# EAGLE design TeensyAmp_R4.1b (EAGLE 9.6.2)

## Sheet 1 of 3
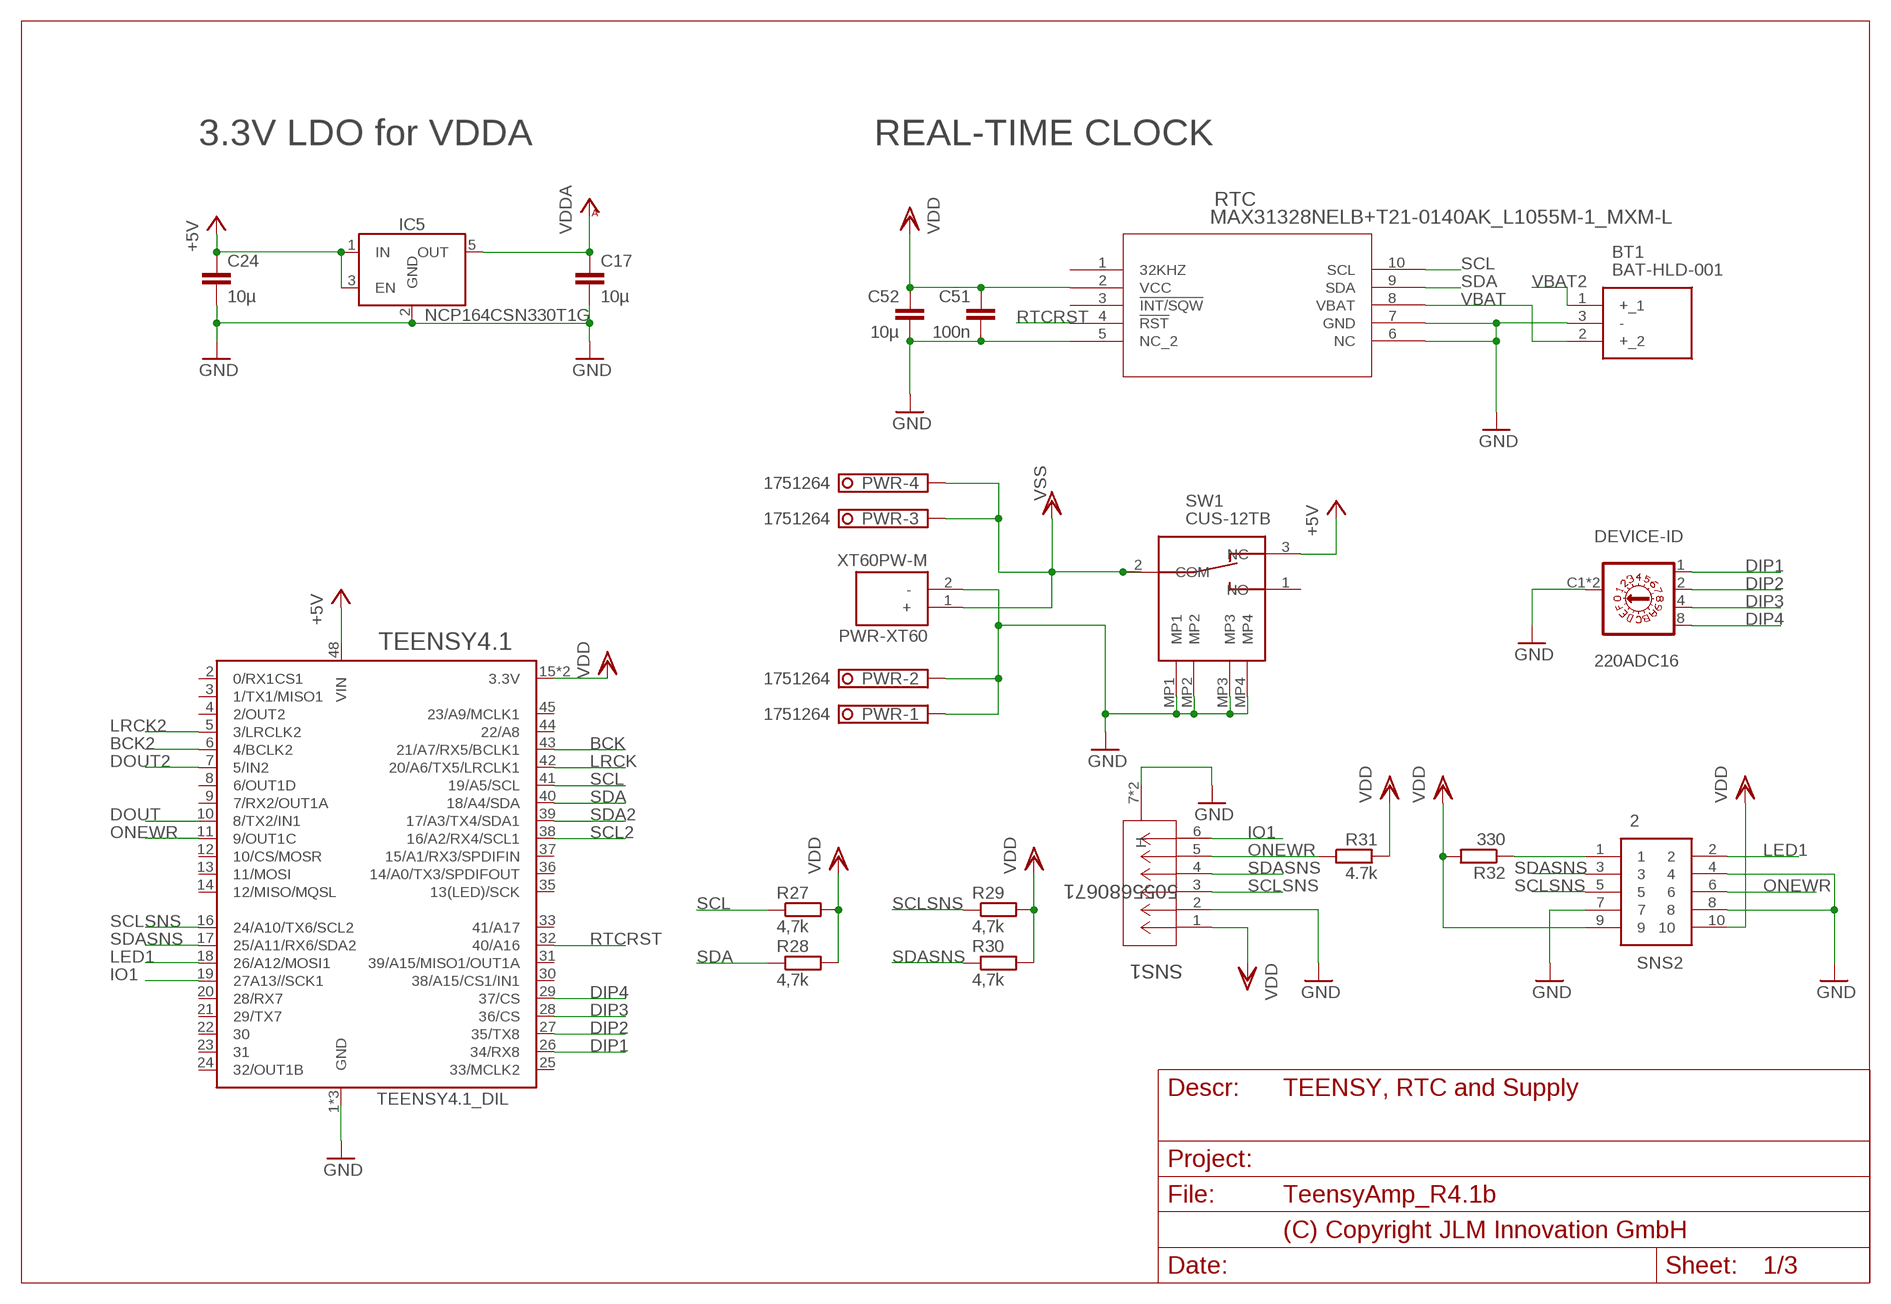
[diagram p0: schematic, sheet 1]
FRAME2 (DINA4_L): PAGE_DESCRIPTION: TEENSY, RTC and Supply

### Parts
BT1  BAT-HLD-001  [BATHLD001]
C17  10µ  C-EUC0603  [C0603]
C24  10µ  C-EUC0603  [C0603]
C51  100n  C-EUC0603  [C0603]
C52  10µ  C-EUC0603  [C0603]
DEVICE-ID  220ADC16  [220ADC16-CTS]
IC5  NCP164CSN330T1G  LDO_ENSOT23-5  [SOT23-5]
PWR  1751264  [1751264]
PWR-XT60  XT60PW-M  [AMASS_XT60PW-M]
R27  4,7k  R_JLMR0603  [R0603]
R28  4,7k  R_JLMR0603  [R0603]
R29  4,7k  R_JLMR0603  [R0603]
R30  4,7k  R_JLMR0603  [R0603]
R31  4.7k  R_JLMR0603  [R0603]
R32  330  R_JLMR0603  [R0603]
RTC  MAX31328NELB+T21-0140AK_L1055M-1_MXM-L  [21-0140AK_L1055M-1_MXM-L]
SNS1  5055680671  [CONN_50556806XX_MOL]
SNS2  2  JUMPER2X5  [JUMPER2X5FP]
SW1  CUS-12TB  [CUS12TB]
TEENSY4.1  TEENSY4.1_DIL  [TEENSY4.1_DIL]

### Nets
+5V: C24.1 IC5.1(IN) IC5.3(EN) SW1.3(NC) TEENSY4.1.48(VIN)
BCK: TEENSY4.1.43(21/A7/RX5/BCLK1) ; also sheet 2,3
BCK2: TEENSY4.1.6(4/BCLK2)
DIP1: DEVICE-ID.1 TEENSY4.1.26(34/RX8)
DIP2: DEVICE-ID.2 TEENSY4.1.27(35/TX8)
DIP3: DEVICE-ID.4 TEENSY4.1.28(36/CS)
DIP4: DEVICE-ID.8 TEENSY4.1.29(37/CS)
DOUT: TEENSY4.1.10(8/TX2/IN1) ; also sheet 2,3
DOUT2: TEENSY4.1.7(5/IN2)
GND: BT1.3(-) C17.2 C24.2 C51.2 C52.2 DEVICE-ID.C1(C) DEVICE-ID.C2(C) IC5.2(GND) PWR-XT60.2(-) PWR.1 PWR.2 RTC.5(NC_2) RTC.6(NC) RTC.7(GND) SNS1.2 SNS1.7(H) SNS1.8(H) SNS2.4 SNS2.7 SNS2.8 SW1.MP1 SW1.MP2 SW1.MP3 SW1.MP4 TEENSY4.1.1(GND) TEENSY4.1.34(GND) TEENSY4.1.47(GND) ; also sheet 2,3
IO1: SNS1.6 TEENSY4.1.19(27A13//SCK1)
LED1: SNS2.2 TEENSY4.1.18(26/A12/MOSI1)
LRCK: TEENSY4.1.42(20/A6/TX5/LRCLK1) ; also sheet 2,3
LRCK2: TEENSY4.1.5(3/LRCLK2)
N$1: R32.1 SNS2.1
ONEWR: R31.1 SNS1.5 SNS2.6 TEENSY4.1.11(9/OUT1C)
RTCRST: RTC.4(!RST) TEENSY4.1.32(40/A16)
SCL: R27.1 RTC.10(SCL) TEENSY4.1.41(19/A5/SCL) ; also sheet 2,3
SCL2: TEENSY4.1.38(16/A2/RX4/SCL1)
SCLSNS: R29.1 SNS1.3 SNS2.5 TEENSY4.1.16(24/A10/TX6/SCL2)
SDA: R28.1 RTC.9(SDA) TEENSY4.1.40(18/A4/SDA) ; also sheet 2,3
SDA2: TEENSY4.1.39(17/A3/TX4/SDA1)
SDASNS: R30.1 SNS1.4 SNS2.3 TEENSY4.1.17(25/A11/RX6/SDA2)
VBAT: BT1.2(+_2) RTC.8(VBAT)
VBAT2: BT1.1(+_1)
VDD: C51.1 C52.1 R27.2 R28.2 R29.2 R30.2 R31.2 R32.2 RTC.2(VCC) SNS1.1 SNS2.9 SNS2.10 TEENSY4.1.15(3.3V) TEENSY4.1.46(3.3V) ; also sheet 2,3
VDDA: C17.1 IC5.5(OUT) ; also sheet 2,3
VSS: PWR-XT60.1(+) PWR.3 PWR.4 SW1.2(COM)
Unconnected: RTC.1(32KHZ) RTC.3(!INT/SQW) SW1.1(NO) TEENSY4.1.2(0/RX1CS1) TEENSY4.1.3(1/TX1/MISO1) TEENSY4.1.4(2/OUT2) TEENSY4.1.8(6/OUT1D) TEENSY4.1.9(7/RX2/OUT1A) TEENSY4.1.12(10/CS/MOSR) TEENSY4.1.13(11/MOSI) TEENSY4.1.14(12/MISO/MQSL) TEENSY4.1.20(28/RX7) TEENSY4.1.21(29/TX7) TEENSY4.1.22 TEENSY4.1.23 TEENSY4.1.24(32/OUT1B) TEENSY4.1.25(33/MCLK2) TEENSY4.1.30(38/A15/CS1/IN1) TEENSY4.1.31(39/A15/MISO1/OUT1A) TEENSY4.1.33(41/A17) TEENSY4.1.35(13(LED)/SCK) TEENSY4.1.36(14/A0/TX3/SPDIFOUT) TEENSY4.1.37(15/A1/RX3/SPDIFIN) TEENSY4.1.44(22/A8) TEENSY4.1.45(23/A9/MCLK1)

### Notes on the sheet
- 3.3V LDO for VDDA | REAL-TIME CLOCK

## Sheet 2 of 3
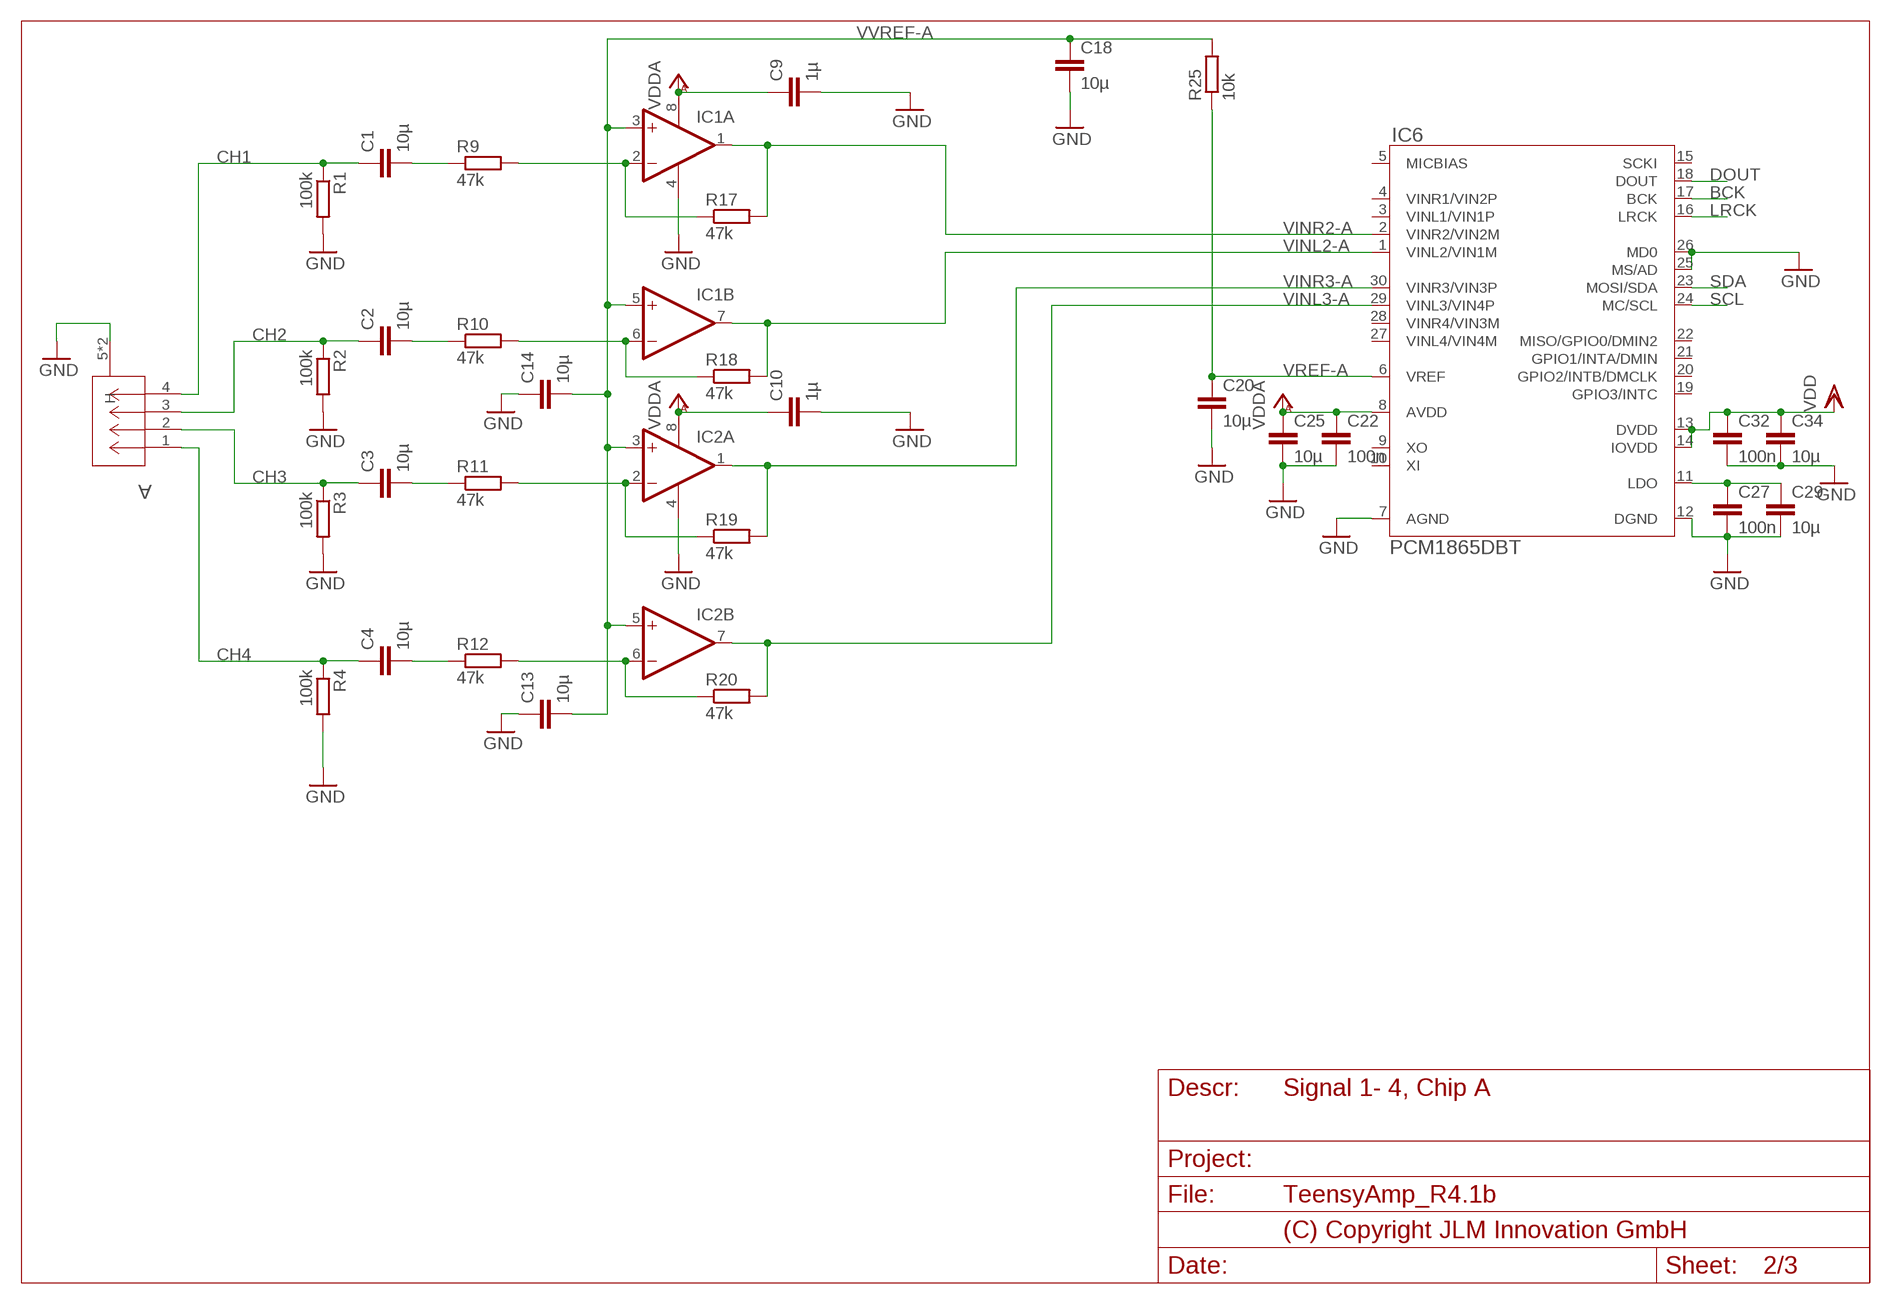
[diagram p1: schematic, sheet 2]
FRAME1 (DINA4_L): PAGE_DESCRIPTION: Signal 1- 4, Chip A

### Parts
A  5055670471  [CONN04_5055670471_MOL]
C1  10µ  C-EUC0805  [C0805]
C2  10µ  C-EUC0805  [C0805]
C3  10µ  C-EUC0805  [C0805]
C4  10µ  C-EUC0805  [C0805]
C9  1µ  C-EUC0603  [C0603]
C10  1µ  C-EUC0603  [C0603]
C13  10µ  C-EUC0603  [C0603]
C14  10µ  C-EUC0603  [C0603]
C18  10µ  C-EUC0603  [C0603]
C20  10µ  C-EUC0603  [C0603]
C22  100n  C-EUC0603  [C0603]
C25  10µ  C-EUC0603  [C0603]
C27  100n  C-EUC0603  [C0603]
C29  10µ  C-EUC0603  [C0603]
C32  100n  C-EUC0603  [C0603]
C34  10µ  C-EUC0603  [C0603]
IC1  OPA2344E  [MSOP08]
IC2  OPA2344E  [MSOP08]
IC6  PCM1865DBT  [SOP50P640X120-30N]
R1  100k  R_JLMR0603  [R0603]
R2  100k  R_JLMR0603  [R0603]
R3  100k  R_JLMR0603  [R0603]
R4  100k  R_JLMR0603  [R0603]
R9  47k  R_JLMR0603  [R0603]
R10  47k  R_JLMR0603  [R0603]
R11  47k  R_JLMR0603  [R0603]
R12  47k  R_JLMR0603  [R0603]
R17  47k  R_JLMR0603  [R0603]
R18  47k  R_JLMR0603  [R0603]
R19  47k  R_JLMR0603  [R0603]
R20  47k  R_JLMR0603  [R0603]
R25  10k  R_JLMR0603  [R0603]

### Nets
BCK: IC6.17(BCK) ; also sheet 1,3
CH1: A.4 C1.1 R1.1
CH2: A.3 C2.1 R2.1
CH3: A.2 C3.1 R3.1
CH4: A.1 C4.1 R4.1
DOUT: IC6.18(DOUT) ; also sheet 1,3
GND: A.5(H) A.6(H) C9.2 C10.2 C13.1 C14.1 C18.2 C20.2 C22.2 C25.2 C27.2 C29.2 C32.2 C34.2 IC1.4(A:V-) IC2.4(A:V-) IC6.7(AGND) IC6.12(DGND) IC6.25(MS/AD) IC6.26(MD0) R1.2 R2.2 R3.2 R4.2 ; also sheet 1,3
LRCK: IC6.16(LRCK) ; also sheet 1,3
N$11: C27.1 C29.1 IC6.11(LDO)
N$23: C2.2 R10.1
N$24: C3.2 R11.1
N$25: C1.2 R9.1
N$26: C4.2 R12.1
N$31: IC1.2(A:-IN) R9.2 R17.1
N$32: IC1.6(B:-IN) R10.2 R18.1
N$33: IC2.2(A:-IN) R11.2 R19.1
N$34: IC2.6(B:-IN) R12.2 R20.1
SCL: IC6.24(MC/SCL) ; also sheet 1,3
SDA: IC6.23(MOSI/SDA) ; also sheet 1,3
VDD: C32.1 C34.1 IC6.13(DVDD) IC6.14(IOVDD) ; also sheet 1,3
VDDA: C9.1 C10.1 C22.1 C25.1 IC1.8(A:V+) IC2.8(A:V+) IC6.8(AVDD) ; also sheet 1,3
VINL2-A: IC1.7(B:OUT) IC6.1(VINL2/VIN1M) R18.2
VINL3-A: IC2.7(B:OUT) IC6.29(VINL3/VIN4P) R20.2
VINR2-A: IC1.1(A:OUT) IC6.2(VINR2/VIN2M) R17.2
VINR3-A: IC2.1(A:OUT) IC6.30(VINR3/VIN3P) R19.2
VREF-A: C20.1 IC6.6(VREF) R25.1
VVREF-A: C13.2 C14.2 C18.1 IC1.3(A:+IN) IC1.5(B:+IN) IC2.3(A:+IN) IC2.5(B:+IN) R25.2
Unconnected: IC6.3(VINL1/VIN1P) IC6.4(VINR1/VIN2P) IC6.5(MICBIAS) IC6.9(XO) IC6.10(XI) IC6.15(SCKI) IC6.19(GPIO3/INTC) IC6.20(GPIO2/INTB/DMCLK) IC6.21(GPIO1/INTA/DMIN) IC6.22(MISO/GPIO0/DMIN2) IC6.27(VINL4/VIN4M) IC6.28(VINR4/VIN3M)

## Sheet 3 of 3
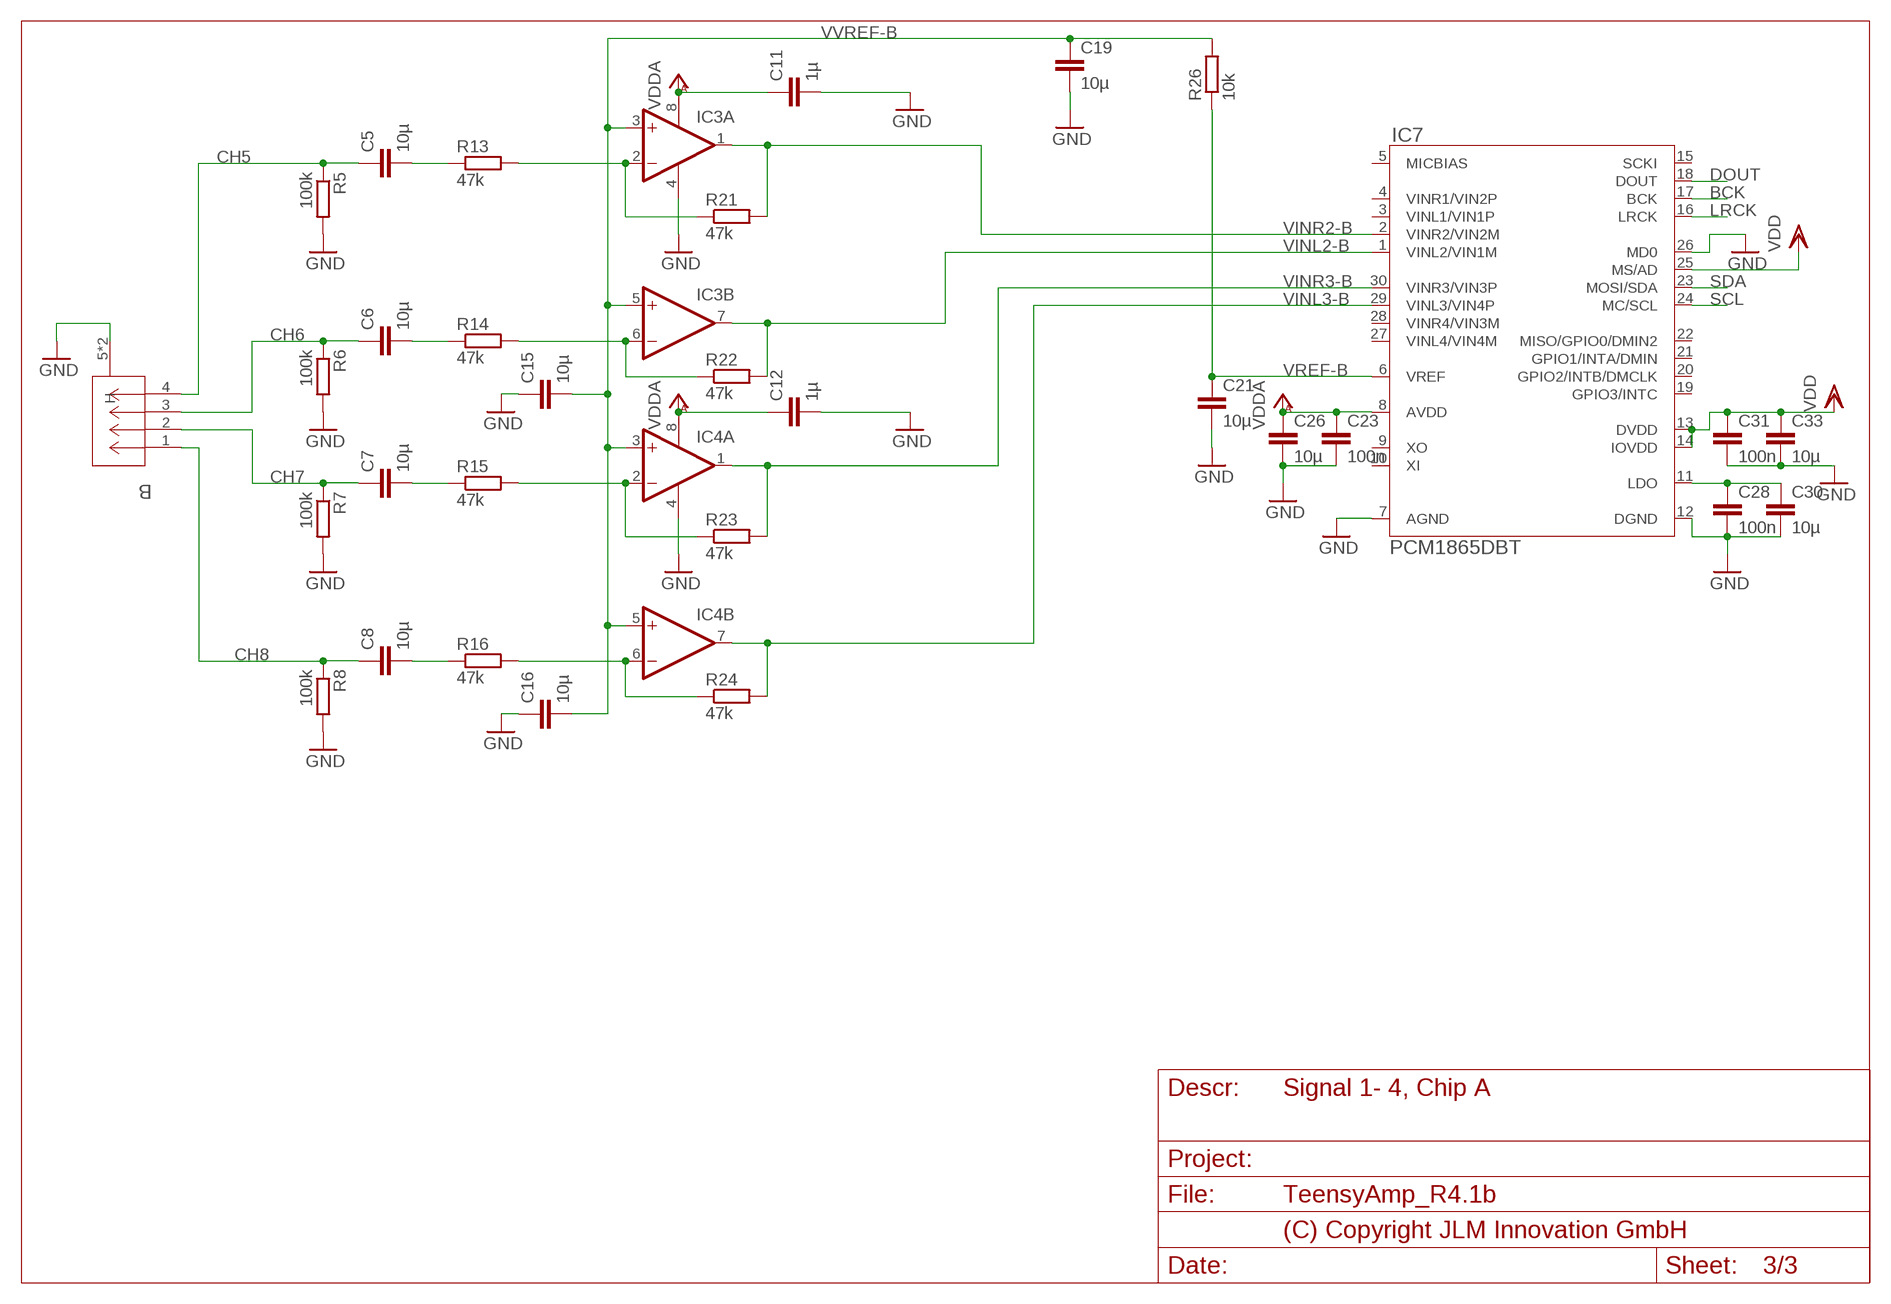
[diagram p2: schematic, sheet 3]
FRAME3 (DINA4_L): PAGE_DESCRIPTION: Signal 1- 4, Chip A

### Parts
B  5055670471  [CONN04_5055670471_MOL]
C5  10µ  C-EUC0805  [C0805]
C6  10µ  C-EUC0805  [C0805]
C7  10µ  C-EUC0805  [C0805]
C8  10µ  C-EUC0805  [C0805]
C11  1µ  C-EUC0603  [C0603]
C12  1µ  C-EUC0603  [C0603]
C15  10µ  C-EUC0603  [C0603]
C16  10µ  C-EUC0603  [C0603]
C19  10µ  C-EUC0603  [C0603]
C21  10µ  C-EUC0603  [C0603]
C23  100n  C-EUC0603  [C0603]
C26  10µ  C-EUC0603  [C0603]
C28  100n  C-EUC0603  [C0603]
C30  10µ  C-EUC0603  [C0603]
C31  100n  C-EUC0603  [C0603]
C33  10µ  C-EUC0603  [C0603]
IC3  OPA2344E  [MSOP08]
IC4  OPA2344E  [MSOP08]
IC7  PCM1865DBT  [SOP50P640X120-30N]
R5  100k  R_JLMR0603  [R0603]
R6  100k  R_JLMR0603  [R0603]
R7  100k  R_JLMR0603  [R0603]
R8  100k  R_JLMR0603  [R0603]
R13  47k  R_JLMR0603  [R0603]
R14  47k  R_JLMR0603  [R0603]
R15  47k  R_JLMR0603  [R0603]
R16  47k  R_JLMR0603  [R0603]
R21  47k  R_JLMR0603  [R0603]
R22  47k  R_JLMR0603  [R0603]
R23  47k  R_JLMR0603  [R0603]
R24  47k  R_JLMR0603  [R0603]
R26  10k  R_JLMR0603  [R0603]

### Nets
BCK: IC7.17(BCK) ; also sheet 1,2
CH5: B.4 C5.1 R5.1
CH6: B.3 C6.1 R6.1
CH7: B.2 C7.1 R7.1
CH8: B.1 C8.1 R8.1
DOUT: IC7.18(DOUT) ; also sheet 1,2
GND: B.5(H) B.6(H) C11.2 C12.2 C15.1 C16.1 C19.2 C21.2 C23.2 C26.2 C28.2 C30.2 C31.2 C33.2 IC3.4(A:V-) IC4.4(A:V-) IC7.7(AGND) IC7.12(DGND) IC7.26(MD0) R5.2 R6.2 R7.2 R8.2 ; also sheet 1,2
LRCK: IC7.16(LRCK) ; also sheet 1,2
N$43: C28.1 C30.1 IC7.11(LDO)
N$48: IC3.2(A:-IN) R13.2 R21.1
N$49: IC3.6(B:-IN) R14.2 R22.1
N$50: IC4.2(A:-IN) R15.2 R23.1
N$51: IC4.6(B:-IN) R16.2 R24.1
N$52: C6.2 R14.1
N$53: C7.2 R15.1
N$54: C8.2 R16.1
N$55: C5.2 R13.1
SCL: IC7.24(MC/SCL) ; also sheet 1,2
SDA: IC7.23(MOSI/SDA) ; also sheet 1,2
VDD: C31.1 C33.1 IC7.13(DVDD) IC7.14(IOVDD) IC7.25(MS/AD) ; also sheet 1,2
VDDA: C11.1 C12.1 C23.1 C26.1 IC3.8(A:V+) IC4.8(A:V+) IC7.8(AVDD) ; also sheet 1,2
VINL2-B: IC3.7(B:OUT) IC7.1(VINL2/VIN1M) R22.2
VINL3-B: IC4.7(B:OUT) IC7.29(VINL3/VIN4P) R24.2
VINR2-B: IC3.1(A:OUT) IC7.2(VINR2/VIN2M) R21.2
VINR3-B: IC4.1(A:OUT) IC7.30(VINR3/VIN3P) R23.2
VREF-B: C21.1 IC7.6(VREF) R26.1
VVREF-B: C15.2 C16.2 C19.1 IC3.3(A:+IN) IC3.5(B:+IN) IC4.3(A:+IN) IC4.5(B:+IN) R26.2
Unconnected: IC7.3(VINL1/VIN1P) IC7.4(VINR1/VIN2P) IC7.5(MICBIAS) IC7.9(XO) IC7.10(XI) IC7.15(SCKI) IC7.19(GPIO3/INTC) IC7.20(GPIO2/INTB/DMCLK) IC7.21(GPIO1/INTA/DMIN) IC7.22(MISO/GPIO0/DMIN2) IC7.27(VINL4/VIN4M) IC7.28(VINR4/VIN3M)

## Library data of the parts
A B = teensyamp:5055670471: molex micro-lock plus horizontal header 4 pins; COPYRIGHT: Copyright (C) 2025 Ultra Librarian. All rights reserved.; MANUFACTURER_PART_NUMBER: 5055670471; MFR_NAME: Molex Connector Corporation
BT1 = teensyamp:BAT-HLD-001: Battery Holders, CR2032, 1 Position, Horizontal, Nickel, PCB Mount Alignment, Power, -40 257 F [-40 125 C] Source: Datasheet <https://www.te.com/commerce/DocumentDelivery/DDEController?Action=showdoc&DocId=Customer DrawingC-BAT-HLD-001-xxEpdfEnglishENG_CD_C-BAT-HLD-001-xx_E.pdfBAT-HLD-001>; DESCRIPTION: Battery Holders, CR2032, 1 Position, Horizontal, Nickel, PCB Mount Alignment, Power, -40 257 F [-40 125 C]; HEIGHT: 4.3mm; MANUFACTURER_NAME: TE Connectivity; MANUFACTURER_PART_NUMBER: BAT-HLD-001; MOUSER_PART_NUMBER: 712-BAT-HLD-001; MOUSER_PRICE-STOCK: https://www.mouser.co.uk/ProductDetail/TE-Connectivity-Linx-Technologies/BAT-HLD-001?qs=K5ta8V%252BWhta7hbVGfm4dqA%3D%3D
C1-C34 C51 C52 = jlm_cap:C-EU: CAPACITOR, European symbol
DEVICE-ID = teensyamp:220ADC16: DIL/CODE SWITCH; MPN: DRS3016; OC_FARNELL: 1190425; OC_NEWARK: 01M7367
IC1-IC4 = jlm_linear:OPA2*: Dual Operational Amplifier Low Power, Single-Supply, Rail-To-Rail Operational Amplifier Source: http://focus.ti.com/lit/ds/symlink/opa2345.pdf http://focus.ti.com .. opa241.pdf http://focus.ti.com/lit/ds/symlink/opa2134.pdf
IC5 = jlm_power:LDO_EN; OC_FARNELL: 3367831; OC_MOUSER: 863-NCP164CSN330T1G
IC6 IC7 = jlm_adc_dac:PCM1865: PCM1865 4-Channel, 192-kHz, Audio ADCs; OC_MOUSER: 595-PCM1865DBT
PWR = jlm_con:1751264: MKDS 1/ 4-3,5 Printklemme Nennstrom: 10 A Bemessungsspannung: 160 V Raster: 3,5 mm Polzahl: 4 Montageart: Löten Anschlussart: Schraubanschluss Anschlussrichtung vom Leiter zur Platine: 0° Source: http://eshop.phoenixcontact.com .. 1751264.pdf; MPN: 1751264; OC_FARNELL: 2478588; OC_NEWARK: 10R0934
PWR-XT60 = teensyamp:XT60PW-M: XT60 male through hole; AVAILABILITY: Not in stock; CHECK_PRICES: https://www.snapeda.com/parts/XT60PW-M/AMASS/view-part/?ref=eda; DESCRIPTION: Socket, DC supply, male, PIN: 2; MF: AMASS; MP: XT60PW-M; PACKAGE: Package; PRICE: None; SNAPEDA_LINK: https://www.snapeda.com/parts/XT60PW-M/AMASS/view-part/?ref=snap
R1-R32 = jlm_resistors:R_JLM: RESISTOR, European symbol
RTC = teensyamp:MAX31328NELB+T: MAX31328 real-time clock; COPYRIGHT: Copyright (C) 2025 Ultra Librarian. All rights reserved.; MANUFACTURER_PART_NUMBER: MAX31328NELB+T; MFR_NAME: Analog Devices Inc
SNS1 = teensyamp:5055680671: molex micro-lock plus vertical header 6 pins; COPYRIGHT: Copyright (C) 2025 Ultra Librarian. All rights reserved.; MANUFACTURER_PART_NUMBER: 5055680671; MFR_NAME: Molex Connector Corporation
SNS2 = teensyamp:JUMPER2X5: Jumper with 10 pins in 2 rows
SW1 = teensyamp:CUS-12TB: Slide Switches smd low profile slide switch, 1P2T, gull wing Source: Datasheet <https://www.nidec-copal-electronics.com/e/catalog/switch/cus.pdf>; DESCRIPTION: Slide Switches smd low profile slide switch, 1P2T, gull wing; HEIGHT: 1.4mm; MANUFACTURER_NAME: Nidec Copal; MANUFACTURER_PART_NUMBER: CUS-12TB
TEENSY4.1 = jlm_micro:TEENSY4.1_DIL

## Net classes
0 default: clearance 0.205 mm

## Board
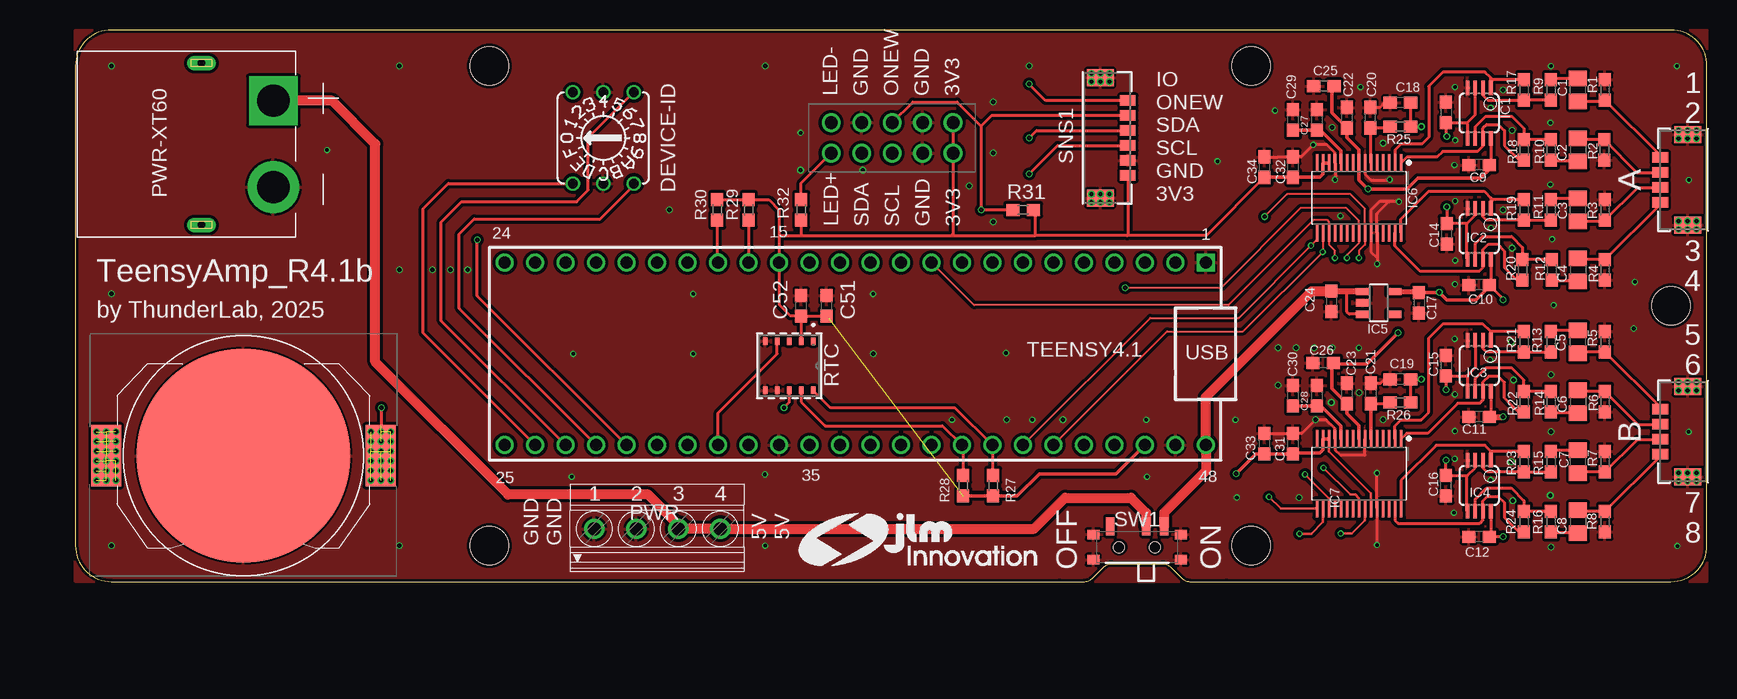
[diagram p3: board, top side]
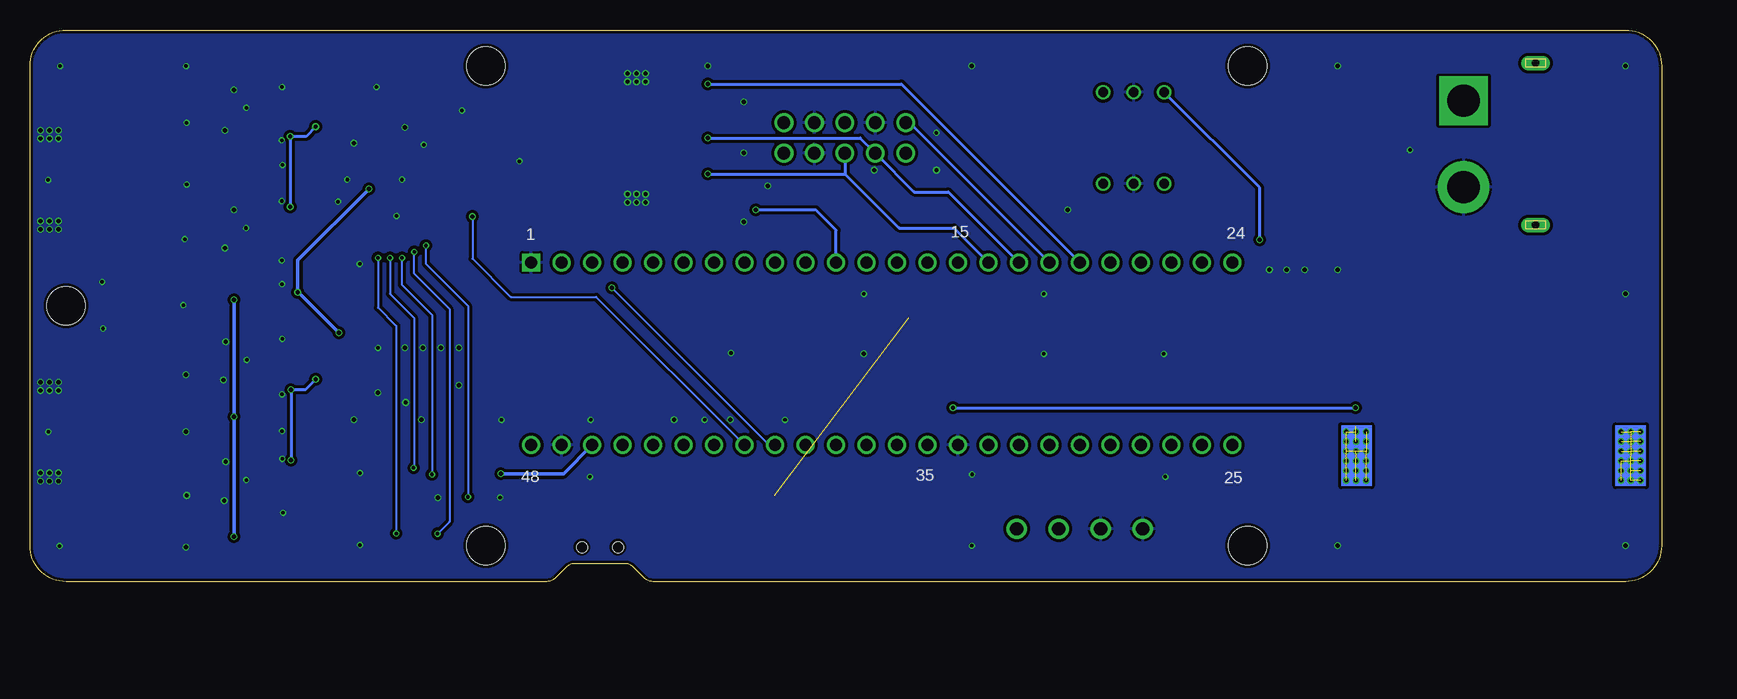
[diagram p4: board, bottom side, seen from below]

Size 136 x 46 mm. Coordinates in mm from the lower left corner, seen from the top.
Outline: 82,0 3,0 arc-90 0,3 0,43 arc-90 3,46 133,46 arc-90 136,43 136,3 arc-90 133,0 96,0
Outline: 82,0 82.09,0
Outline: 95.91,0 96,0
Outline: 82,0 84.09,0 arc45 84.79,0.29 85.71,1.21 arc-45 86.41,1.5 90.59,1.5 arc-45 91.29,1.21 92.21,0.29 arc45 92.91,0 96,0
Copper layers (1*16): Top 0.018mm / dielectric 1.55mm / Bottom 0.018mm
Design rules "Multi-CB_2L_100цm-Tracks_OL35цm *": minimum track width 0.1mm, minimum drill 0.2mm, track to track 0.1mm, track to pad 0.1mm, pad to pad 0.1mm, via to via 0.1mm, smd to smd 0mil, copper to edge 0.2mm, drill to drill 0.2mm, minimum pad ring 0.125mm, minimum via ring 0.1mm, stop-mask expansion 2mil, vias tented up to drill 0mil, thermal gap 0.2mm
Holes 3.2 mm at 34.5,3 98,3 34.5,43 98,43 133,23

### Footprints (pad centres in the part's own frame; a part is rotated, then mirrored left to right if it is on the bottom)
CONN04_5055670471_MOL = smd 0.838 x 1.295: 1 1.875,-1.894; 2 0.625,-1.894; 3 -0.625,-1.894; 4 -1.875,-1.894 | smd 1.397 x 2.261: 5 -3.775,0.401; 6 3.775,0.401
BATHLD001 = smd 2.5 x 5.1: 1 -11.45,0; 2 11.43,0 | smd 17.8 x 17.8: 3 0,0
C0805 = smd 1.3 x 1.5: 1 -0.95,0; 2 0.95,0
C0603 = smd 1.1 x 1: 1 -0.85,0; 2 0.85,0
220ADC16-CTS = drill 0.8: 1 -3.81,2.54; 2 3.81,-2.54; 4 -3.81,-2.54; 8 3.81,2.54; C1 -3.81,0; C2 3.81,0
MSOP08 = smd 0.3 x 1.2: 1 -0.976,-2.113; 2 -0.326,-2.113; 3 0.324,-2.113; 4 0.974,-2.113; 5 0.974,2.112; 6 0.324,2.112; 7 -0.326,2.112; 8 -0.976,2.112
SOT23-5 = smd 0.6 x 1.2: 1 -0.95,-1.306; 2 0,-1.306; 3 0.95,-1.306; 4 0.95,1.306; 5 -0.95,1.306
SOP50P640X120-30N = smd 1.5 x 0.28: 1 -2.9,3.5; 2 -2.9,3; 3 -2.9,2.5; 4 -2.9,2; 5 -2.9,1.5; 6 -2.9,1; 7 -2.9,0.5; 8 -2.9,0; 9 -2.9,-0.5; 10 -2.9,-1; 11 -2.9,-1.5; 12 -2.9,-2; 13 -2.9,-2.5; 14 -2.9,-3; 15 -2.9,-3.5; 16 2.9,-3.5; 17 2.9,-3; 18 2.9,-2.5; 19 2.9,-2; 20 2.9,-1.5; 21 2.9,-1; 22 2.9,-0.5; 23 2.9,0; 24 2.9,0.5; 25 2.9,1; 26 2.9,1.5; 27 2.9,2; 28 2.9,2.5; 29 2.9,3; 30 2.9,3.5
1751264 = drill 1.1 pad 1.7: 1 -5.25,-0.1; 2 -1.75,-0.1; 3 1.75,-0.1; 4 5.25,-0.1
AMASS_XT60PW-M = drill 2.7 pad 4.064 square: 1 3.6,-6 | drill 2.7 pad 4.318: 2 -3.6,-6 | drill 0.6 pad 1.2 long: S1 6.75,0; S2 -6.75,0
R0603 = smd 1.1 x 1: 1 -0.85,0; 2 0.85,0
21-0140AK_L1055M-1_MXM-L = smd 0.61 x 0.406: 1 -2.045,2; 2 -2.045,1; 3 -2.045,0; 4 -2.045,-1; 5 -2.045,-2; 6 2.045,-2; 7 2.045,-1; 8 2.045,0; 9 2.045,1; 10 2.045,2
CONN_50556806XX_MOL = smd 0.838 x 1.295: 1 -3.125,-1.72; 2 -1.875,-1.72; 3 -0.625,-1.72; 4 0.625,-1.72; 5 1.875,-1.72; 6 3.125,-1.72 | smd 1.397 x 2.261: 7 -5.025,0.575; 8 5.025,0.575
JUMPER2X5FP = drill 1.05 pad 1.575: 1 0,-1.27; 2 0,1.27; 3 2.54,-1.27; 4 2.54,1.27; 5 5.08,-1.27; 6 5.08,1.27; 7 7.62,-1.27; 8 7.62,1.27; 9 10.16,-1.27; 10 10.16,1.27
CUS12TB = smd 0.7 x 1.5: 1 -0.75,1.75; 2 2.25,1.75; 3 3.75,1.75 | smd 1 x 0.8: MP1 -2.15,1.05; MP2 5.15,1.05; MP3 -2.15,-1.05; MP4 5.15,-1.05 | hole 0.9: 0,0; 3,0
TEENSY4.1_DIL = drill 1 square: 1 -29.21,-7.62 | drill 1: 2 -26.67,-7.62; 3 -24.13,-7.62; 4 -21.59,-7.62; 5 -19.05,-7.62; 6 -16.51,-7.62; 7 -13.97,-7.62; 8 -11.43,-7.62; 9 -8.89,-7.62; 10 -6.35,-7.62; 11 -3.81,-7.62; 12 -1.27,-7.62; 13 1.27,-7.62; 14 3.81,-7.62; 15 6.35,-7.62; 16 8.89,-7.62; 17 11.43,-7.62; 18 13.97,-7.62; 19 16.51,-7.62; 20 19.05,-7.62; 21 21.59,-7.62; 22 24.13,-7.62; 23 26.67,-7.62; 24 29.21,-7.62; 25 29.21,7.62; 26 26.67,7.62; 27 24.13,7.62; 28 21.59,7.62; 29 19.05,7.62; 30 16.51,7.62; 31 13.97,7.62; 32 11.43,7.62; 33 8.89,7.62; 34 6.35,7.62; 35 3.81,7.62; 36 1.27,7.62; 37 -1.27,7.62; 38 -3.81,7.62; 39 -6.35,7.62; 40 -8.89,7.62; 41 -11.43,7.62; 42 -13.97,7.62; 43 -16.51,7.62; 44 -19.05,7.62; 45 -21.59,7.62; 46 -24.13,7.62; 47 -26.67,7.62; 48 -29.21,7.62

### Placement (x,y rotation side)
A  134,33.5 270 top
B  134,12.5 270 top
BT1  14,10.5 0 top
C1  125.25,41 90 top
C2  125.25,36 270 top
C3  125.25,31 90 top
C4  125.25,26 270 top
C5  125.25,20 90 top
C6  125.25,15 270 top
C7  125.25,10 90 top
C8  125.25,5 270 top
C9  117,34.75 180 top
C10  117,24.75 180 top
C11  117,13.75 180 top
C12  117,3.75 180 top
C13  114.25,39.12 270 top
C14  114.31,29 90 top
C15  114.25,18 270 top
C16  114.25,8 90 top
C17  112,23.25 270 top
C18  110.44,39.94 180 top
C19  110.44,16.88 180 top
C20  107.94,38.69 90 top
C21  108,15.69 90 top
C22  106,38.69 90 top
C23  106,15.69 90 top
C24  104.69,23.38 270 top
C25  104.06,41.31 180 top
C26  104,18.25 180 top
C27  103.5,38.5 90 top
C28  103.5,15.5 90 top
C29  101.5,38.5 90 top
C30  101.5,15.5 90 top
C31  101.5,11.5 90 top
C32  101.5,34.56 90 top
C33  99.12,11.5 90 top
C34  99.12,34.56 90 top
C51  62.62,23 90 top
C52  60.5,23 90 top
DEVICE-ID  44,37 90 top
IC1  117,39.06 180 top
IC2  117,29 180 top
IC3  117,18 180 top
IC4  117,8 180 top
IC5  108.62,23.25 270 top
IC6  107,32 270 top
IC7  107,9 270 top
PWR  48.5,4.5 0 top
PWR-XT60  10.5,36.5 90 top
R1  127.5,41 90 top
R2  127.44,36 270 top
R3  127.5,31 90 top
R4  127.5,26 270 top
R5  127.5,20 90 top
R6  127.5,15 270 top
R7  127.5,10 90 top
R8  127.5,5 270 top
R9  123,41 270 top
R10  123,36 90 top
R11  123,31 270 top
R12  123.06,26 90 top
R13  123,20 270 top
R14  123,15 90 top
R15  123,10 270 top
R16  123,5 90 top
R17  120.75,41 90 top
R18  120.75,36 270 top
R19  120.75,31 90 top
R20  120.62,26 270 top
R21  120.75,20 90 top
R22  120.75,15 270 top
R23  120.75,10 90 top
R24  120.75,5 270 top
R25  110.44,37.94 0 top
R26  110.44,14.94 0 top
R27  76.5,8 270 top
R28  74,8 270 top
R29  56.12,31 90 top
R30  53.5,31 90 top
R31  79,31 0 top
R32  60.5,31 270 top
RTC  59.5,18 270 top
SNS1  86,37 90 top
SNS2  63,37 0 top
SW1  87,2.88 0 top
TEENSY4.1  65,19 180 top
U$1  [JLM_LOGO_MID]  60,1 0 top

### Tracks (layer width: path | path; a pad name or v marks a point on that pad's centre or on a via)
+5V
  Top 0.254: IC5.3 106.2,22.3 106,22.5 106,24.23
  Top 0.508: C24.1 106,24.23 107.29,24.23 IC5.1
  Top 0.813: C24.1 103.06,24.23 94.21,15.38 TEENSY4.1.48 94.21,9.21 90.75,5.75 SW1.3
BCK  (via drill 0.3)
  Top 0.152: IC6.17 104,27.54 v103.96,27.5 97.33,20.87 91,20.87 TEENSY4.1.43
  Top 0.2: IC7.17 104,4.97 103.03,4 v102.03,4
  Bottom 0.152: v102.03,4 101.03,5 101.03,22.75 103.96,25.69 v103.96,27.5
CH1
  Top 0.254: C1.1 127.4,40.05 R1.1 132.11,35.54 A.4
CH2
  Top 0.254: A.3 130.16,34.12 R2.1 125.35,36.85 C2.1
CH3
  Top 0.254: C3.1 127.4,30.05 R3.1 130.22,32.88 A.2
CH4
  Top 0.254: C4.1 125.35,26.85 R4.1 132.11,31.46 A.1
CH5
  Top 0.254: C5.1 125.35,19.15 R5.1 132.11,14.54 B.4
CH6
  Top 0.254: C6.1 125.35,15.85 R6.1 130.22,13.12 B.3
CH7
  Top 0.254: C7.1 125.35,9.15 R7.1 130.22,11.88 B.2
CH8
  Top 0.254: C8.1 125.35,5.85 R8.1 132.11,10.46 B.1
DIP1
  Top 0.254: TEENSY4.1.26 29,20.71 29,31.12 31.07,33.19 DEVICE-ID.1
DIP2
  Top 0.254: TEENSY4.1.27 30.5,21.75 30.5,30 32.19,31.69 41.78,31.69 42.75,32.66 42.75,37.02 DEVICE-ID.2
DIP3
  Top 0.254: TEENSY4.1.28 32,22.79 32,29 33.25,30.25 43.75,30.25 46.54,33.04 DEVICE-ID.4
DIP4  (via drill 0.35)
  Top 0.254: TEENSY4.1.29 33.5,23.83 v33.5,28.5
  Bottom 0.254: v33.5,28.5 33.5,32.85 DEVICE-ID.8
DOUT  (via drill 0.3)
  Top 0.152: v105,27 105,27.6 104.5,28.1 IC6.18 104.5,30 104.31,30.19 103.25,30.19 96.12,23.06 74.91,23.06 TEENSY4.1.10
  Top 0.2: IC7.18 104.5,6.94 v102.5,8.94
  Bottom 0.152: v102.5,8.94 102.5,22.25 105,24.75 v105,27
GND  (via drill 0.3, 0.35)
  Top 0.152: 109.53,33.5 v109.55,33.52 | 108.51,26.99 v108.51,26.5
  Top 0.254: IC7.7 107.5,10.55 105.45,10.55 105,11 IC7.12 104.98,11.92 104.98,12.76 104.24,13.5 v103.38,13.5 102.22,12.35 C31.2 100.35,12.35 100.31,12.31 100.28,12.35 C33.2 | IC6.7 107.5,34 108,33.5 109.53,33.5 | v105,33.52 105.02,33.54 105.02,34.88 IC6.12 104.98,34.92 104.98,35.76 104.32,36.42 v103.17,36.42 102.17,35.42 101.51,35.42 | v108.51,26.5 108.51,29.09 IC6.26 108.5,30.68 109.5,31.68 | v110.33,31.68 109.5,31.68 | 109.5,31.68 108.67,31.68 108,31 IC6.25 108,27.5 108.51,26.99 | v108.5,9.05 IC7.26 v108.5,3.05 | C32.2 101.51,35.42 | C34.2 100.25,35.41 100.26,35.42 101.51,35.42 | C18.2 109.12,39.94 108.72,39.54 C20.2 | C19.2 109.12,16.88 108.79,16.54 C21.2
  other vias: 114.99,15.61 114.97,10.25 117.96,8.46 41.5,19 73.06,13.5 66.5,24 51.5,19 123,43 41.38,8.75 51.5,24 96.7,13.5 105.45,30.5 100,39.29 107.12,41.25 114.99,12.55 117.96,39.51 117.99,29.48 122.94,33.12 134.5,33.5 129.9,21.1 123.1,28.55 122.95,38.26 133.54,2.98 133.5,43 130,25 134.47,12.5 20.98,36 77.56,19.06 117.92,18.49 115,24.8 107,19.5 96.81,7.01 95.2,35.05 57.46,8.94 60.45,37.42 115.01,36.8 114.99,41.24 115.01,31.73 114.95,34.74 115.01,26.79 89.33,8.74 57.5,3 114.91,5.75 114.97,20.25 79.76,13.5 89.26,13.5 123.22,23.05 123,12.5 122.94,7.19 123,2.88 123,17.25 66.5,19 27,26 29.75,26 31.25,26 32.69,26 82.31,13.5 77.62,13.5 119,41 109,36.56 109,13.5 60.44,34.31 65.62,34.31 74.5,33 76.5,35.75 76.5,40 76.5,30 119.81,6.75 119.88,16.81 119.75,27.81 119.75,37.62 27,3 3,3 3,24 3,43 27,43 57.5,43 79.5,43 84.69,42.38 86.19,42.38 85.44,42.38 84.69,41.69 85.44,41.69 86.19,41.69 133.62,37.62 135.12,37.62 134.38,37.62 133.62,36.94 134.38,36.94 135.12,36.94 133.62,30.06 135.12,30.06 134.38,30.06 133.62,29.38 134.38,29.38 135.12,29.38 133.62,16.62 135.12,16.62 134.38,16.62 133.62,15.94 134.38,15.94 135.12,15.94 133.62,9.06 135.12,9.06 134.38,9.06 133.62,8.38 134.38,8.38 135.12,8.38 84.69,32.31 86.19,32.31 85.44,32.31 84.69,31.62 85.44,31.62 86.19,31.62 104.75,19.5 103.25,19.5 101.75,19.5 100.25,19.5 102,7 49.5,31 119,31 119.69,20 119.69,10 100.25,16.38 104.75,37.88 104.69,14.94 107,15.75
  pour Top (isolate 0.254, rank 3): 0,0 0,46 136,46 136,0
  pour Bottom (isolate 0.254): 0,0 0,46 136,46 136,0
IO1  (via drill 0.35)
  Top 0.254: SNS1.6 80.88,40.12 v79.5,41.5
  Bottom 0.254: v79.5,41.5 63.37,41.5 TEENSY4.1.19
LED1
  Bottom 0.254: TEENSY4.1.18 62.68,38.27 SNS2.2
LRCK  (via drill 0.3)
  Top 0.152: IC6.16 103.5,28.52 v103,28.02 96.97,22 89.59,22 TEENSY4.1.42
  Top 0.2: IC7.16 100.46,6.1 v99.5,7.06
  Bottom 0.152: v99.5,7.06 99.5,23 103,26.5 v103,28.02
N$1
  Top 0.254: R32.1 60.5,33.23 SNS2.1
N$11
  Top 0.305: IC6.11 105.5,35.94 103.79,37.65 C27.1 C29.1
N$23
  Top 0.254: C2.2 123.1,35.05 R10.1
N$24
  Top 0.254: R11.1 123.1,31.95 C3.2
N$25
  Top 0.254: C1.2 123.1,41.95 R9.1
N$26
  Top 0.254: C4.2 123.16,25.05 R12.1
N$31
  Top 0.254: R9.2 R17.1 117.72,40.15 117.33,40.55 IC1.2
N$32
  Top 0.254: IC1.6 116.68,37.93 117.56,38.81 119.75,38.81 120.75,37.81 R18.1 R10.2
N$33
  Top 0.254: R11.2 R19.1 117.6,30.15 117.33,30.42 IC2.2
N$34
  Top 0.254: IC2.6 116.68,28.18 117.28,28.78 119.72,28.78 120.62,27.88 R20.1 R12.2
N$43
  Top 0.305: IC7.11 105.5,12.96 103.81,14.65 C28.1 C30.1
N$48
  Top 0.254: IC3.2 117.33,19.42 117.6,19.15 R21.1 R13.2
N$49
  Top 0.254: IC3.6 116.68,16.93 117.56,17.81 119.75,17.81 120.75,16.81 R22.1 R14.2
N$50
  Top 0.254: IC4.2 117.33,9.49 117.66,9.15 R23.1 R15.2
N$51
  Top 0.254: IC4.6 116.68,6.86 117.62,7.81 119.69,7.81 120.75,6.75 R24.1 R16.2
N$52
  Top 0.254: C6.2 123.1,14.05 R14.1
N$53
  Top 0.254: C7.2 123.1,10.95 R15.1
N$54
  Top 0.254: C8.2 123.1,4.05 R16.1
N$55
  Top 0.254: C5.2 123.1,20.95 R13.1
ONEWR  (via drill 0.35)
  Top 0.254: R31.1 v75.5,31 75.5,38 | 75.5,38 73.5,40 69.81,40 SNS2.6 | SNS1.5 76.38,38.88 75.5,38
  Bottom 0.254: TEENSY4.1.11 68.81,29.31 70.5,31 v75.5,31
RTCRST
  Top 0.254: RTC.4 58.5,19 53.57,14.07 TEENSY4.1.32
SCL  (via drill 0.3, 0.35)
  Top 0.152: v107,27 107,27.6 107.5,28.1 IC6.24 107.5,31.1 106.29,32.31 101,32.31 v99.12,30.44
  Top 0.2: IC7.24 107.5,5.1 106.41,4.01 v105.47,4.01
  Top 0.254: R27.1 76.43,8.92 TEENSY4.1.41 73.31,14.5 62.95,14.5 RTC.10
  Bottom 0.152: v107,27 107,22.85 105.47,21.32 v105.47,4.01 | v99.12,30.44 99.12,26.94 95.94,23.75 88.8,23.75 TEENSY4.1.41
SCLSNS  (via drill 0.35)
  Top 0.254: v79.5,34 81.88,36.38 SNS1.3 | R29.1 56.12,26.64 TEENSY4.1.16
  Bottom 0.254: TEENSY4.1.16 58.99,29.5 63.56,29.5 68.06,34 | v79.5,34 68.06,34 | 68.06,34 68.04,34.02 68.08,34.06 SNS2.5
SDA  (via drill 0.3, 0.35)
  Top 0.152: v106,27 106,27.25 107,28.25 IC6.23 107,30.1 105.94,31.16 102.12,31.16 95.46,24.5 v87.5,24.5 | TEENSY4.1.40 74,11.27
  Top 0.2: v104.04,9.49 106.27,7.26 106.68,7.26 107,6.93 IC7.23
  Top 0.254: 74,11.27 R28.1 | TEENSY4.1.40 72.27,13 62.5,13 60.5,15 RTC.9
  Bottom 0.152: v106,27 106,24 104,22 104,9.53 v104.04,9.49 | TEENSY4.1.40 74.38,11.38 v87.5,24.5
SDASNS  (via drill 0.35)
  Top 0.254: v79.5,37 80.12,37.62 SNS1.4 | R30.1 53.5,26.69 TEENSY4.1.17
  Bottom 0.254: v79.5,37 66.81,37 SNS2.3 62.31,32.5 59.45,32.5 TEENSY4.1.17
VBAT  (via drill 0.35)  (19 unrouted)
  Top 0.254: v59.06,14.5 59.06,14.52 59.5,14.96 RTC.8 | v25.5,14.5 25.5,12.97
  Bottom 0.254: v59.06,14.5 v25.5,14.5
  other vias: 24.62,10.88 24.62,12.5 24.62,11.69 26.28,10.88 26.28,11.69 26.28,12.5 25.47,10.88 25.47,11.69 25.47,12.5 24.62,10.06 25.47,10.06 26.28,10.06 24.62,9.25 25.47,9.25 26.28,9.25 24.62,8.44 25.47,8.44 26.28,8.44
VBAT2  (via drill 0.35)  (18 unrouted)
  other vias: 1.75,12.5 2.56,12.5 3.38,12.5 1.75,11.69 2.56,11.69 3.38,11.69 1.75,10.88 2.56,10.88 3.38,10.88 1.75,10.06 2.56,10.06 3.38,10.06 1.75,9.25 2.56,9.25 3.38,9.25 1.75,8.44 2.56,8.44 3.38,8.44
VDD  (via drill 0.35)  (1 unrouted)
  Top 0.152: 62.77,22 62.64,22.14
  Top 0.2: IC7.13 104.5,10.85 108,7.35 IC7.25
  Top 0.254: C52.1 RTC.2 | C34.1 94.26,28.85 87.69,28.85 | 87.69,28.85 80,28.85 | C52.1 C51.1 62.64,22.14 | C52.1 59.6,22.15 58.65,23.1 TEENSY4.1.15 58.65,28.81 | 60.5,28.85 58.69,28.85 58.65,28.81 | 60.5,28.85 73,28.85 | 73,28.85 80,28.85 | R31.2 80,30.85 80,28.85 | SNS1.1 87.72,28.88 87.69,28.85 | 73,28.85 73.16,29.01 SNS2.9 SNS2.10 | 58.65,28.81 58.65,31 57.8,31.85 R29.2 R30.2 | R32.2 60.5,28.85
  Top 0.305: IC6.13 IC6.14 104,34 103.71,33.71 C32.1 C34.1 | IC7.13 IC7.14 104,11 103.75,10.75 101.7,10.75 C31.1 C33.1 98.4,10.65 v96.75,9 | TEENSY4.1.46 86.75,9 80.35,9 78.5,7.15 R27.2 R28.2
  Bottom 0.305: v96.75,9 91.51,9 TEENSY4.1.46
VDDA  (via drill 0.35)
  Top 0.254: IC1.8 117.98,34.75 | 117.98,34.75 117.98,34.5 | C9.1 117.98,34.75 | IC4.8 117.98,3.56 118.01,3.59 C12.1 v119,3.75 | IC3.8 117.98,13.88 C11.1 | IC2.8 117.98,24.88 C10.1 119,23.6 v119,23.5
  Top 0.305: 112.03,24.12 v113.69,24.12 114.31,23.5 116.75,23.5 117.85,24.6 | IC7.8 107,13.03 106,14.03 C23.1 104.75,16.09 104.75,18.15 C26.1 104.95,18.15 107.65,18.15 v110.25,20.75 | C25.1 104.72,41.12 104.72,39.11 C22.1 106,37.01 107,36.01 IC6.8 107,33.5 v107.75,32.75 111,32.75 111.89,33.63 117.11,33.63 117.98,34.5
  Top 0.406: IC5.5 111.9,24.2 C17.1 | C10.1 117.85,24.6
  Top 0.508: 112.03,24.12 C17.1 | C11.1 v119,13.75
  Bottom 0.305: v107.75,32.75 113.69,26.81 v113.69,24.12 113.62,24.12 v110.25,20.75 | v119,23.5 v119,13.75 v119,3.75
VINL2-A
  Top 0.254: R18.2 120.35,35.15 119.12,36.38 119.12,37.62 118.62,38.12 117.64,38.12 117.33,37.81 IC1.7 117.33,36.33 116.88,35.88 113.97,35.88 113.5,35.4 111,35.4 IC6.1
VINL2-B
  Top 0.254: IC7.1 110.97,12.38 112.72,12.38 115.22,14.88 117.07,14.88 117.33,15.13 IC3.7 117.33,16.64 117.81,17.12 118.62,17.12 119.12,16.62 119.12,15.31 120.29,14.15 R22.2
VINL3-A
  Top 0.254: IC6.29 110,28 112.12,25.88 117,25.88 117.33,26.2 IC2.7 117.33,27.68 117.78,28.13 118.55,28.13 119.12,27.56 119.12,26.19 120.16,25.15 R20.2
VINL3-B
  Top 0.254: R24.2 120.31,4.15 119.11,5.35 119.11,6.6 118.58,7.12 117.71,7.12 117.33,6.75 IC4.7 117.33,5.14 117.06,4.88 110.25,4.88 110,5.12 IC7.29
VINR2-A
  Top 0.254: IC1.1 117.98,42.02 | 117.98,42.02 117.5,42.5 114,42.5 112.81,41.31 112.81,37.06 112.25,36.5 110.5,36.5 110,36 IC6.2 | R17.2 118.15,41.85 117.98,42.02
VINR2-B
  Top 0.254: IC7.2 110,13 110.5,13.5 112.19,13.5 112.81,14.12 112.81,20.31 114,21.5 117.31,21.5 117.96,20.85 | IC3.1 117.98,20.84 117.96,20.85 | R21.2 117.96,20.85
VINR3-A
  Top 0.254: IC2.1 118,31.11 118,32 | IC6.30 110.5,30.25 112.81,32.56 117.44,32.56 118,32 | 118,32 118.15,31.85 R19.2
VINR3-B
  Top 0.254: IC7.30 110.5,8.44 113.42,11.36 117.49,11.36 118,10.85 | R23.2 118,10.85 | IC4.1 117.98,10.83 118,10.85
VREF-A
  Top 0.254: IC6.6 108,37.78 C20.1 109.49,37.84 R25.1
VREF-B
  Top 0.254: C21.1 109.49,14.84 R26.1
  Top 0.305: IC7.6 C21.1
VSS
  Top 0.813: PWR-XT60.1 21.4,40.1 25,36.5 25,18.32 36.05,7.26 47.74,7.26 50.25,4.75 PWR.3 PWR.4 79.9,4.4 82.5,7 88,7 89.25,5.75 SW1.2
VVREF-A  (via drill 0.35)
  Top 0.254: IC1.3 116.68,38.93 116.03,38.27 | C18.1 R25.2 v112.19,37.94 | v114.31,31.25 C14.2 115.98,29.85 | IC2.3 116.68,30.54 115.98,29.85 | 116.03,38.27 C13.2 114.25,37.19 v114.31,37.12 | 116.03,38.27 115.96,38.21 116.03,38.15 IC1.5 | IC2.5 115.98,26.93 115.98,29.85
  Bottom 0.254: v114.31,31.25 v114.31,37.12 113,37.12 v112.19,37.94
VVREF-B  (via drill 0.35)
  Top 0.254: IC3.3 116.68,17.85 115.97,17.15 | R26.2 C19.1 v112.19,16.88 | 115.97,17.15 C15.2 v114.25,16 | 116,8.85 116.04,8.85 116.68,9.49 IC4.3 | IC4.5 116,5.91 116,8.85 | 115.97,17.15 116.03,17.1 IC3.5 | 116,8.85 C16.2 v114.25,10.12
  Bottom 0.254: v114.25,10.12 v114.25,16 113.06,16 v112.19,16.88

### Text on the board
tNames: 1 | LED- / GND / ONEW / GND / 3V3 | 2 | IO / ONEW / SDA / SCL / GND / 3V3 | LED+ / SDA / SCL / GND / 3V3 | 3 | 4 | by ThunderLab, 2025 | 5 | 6 | USB | 7 | 8 | 5V / 5V | GND / GND | OFF | ON